# EAGLE design Dashboard rev1 (EAGLE 9.5.0)
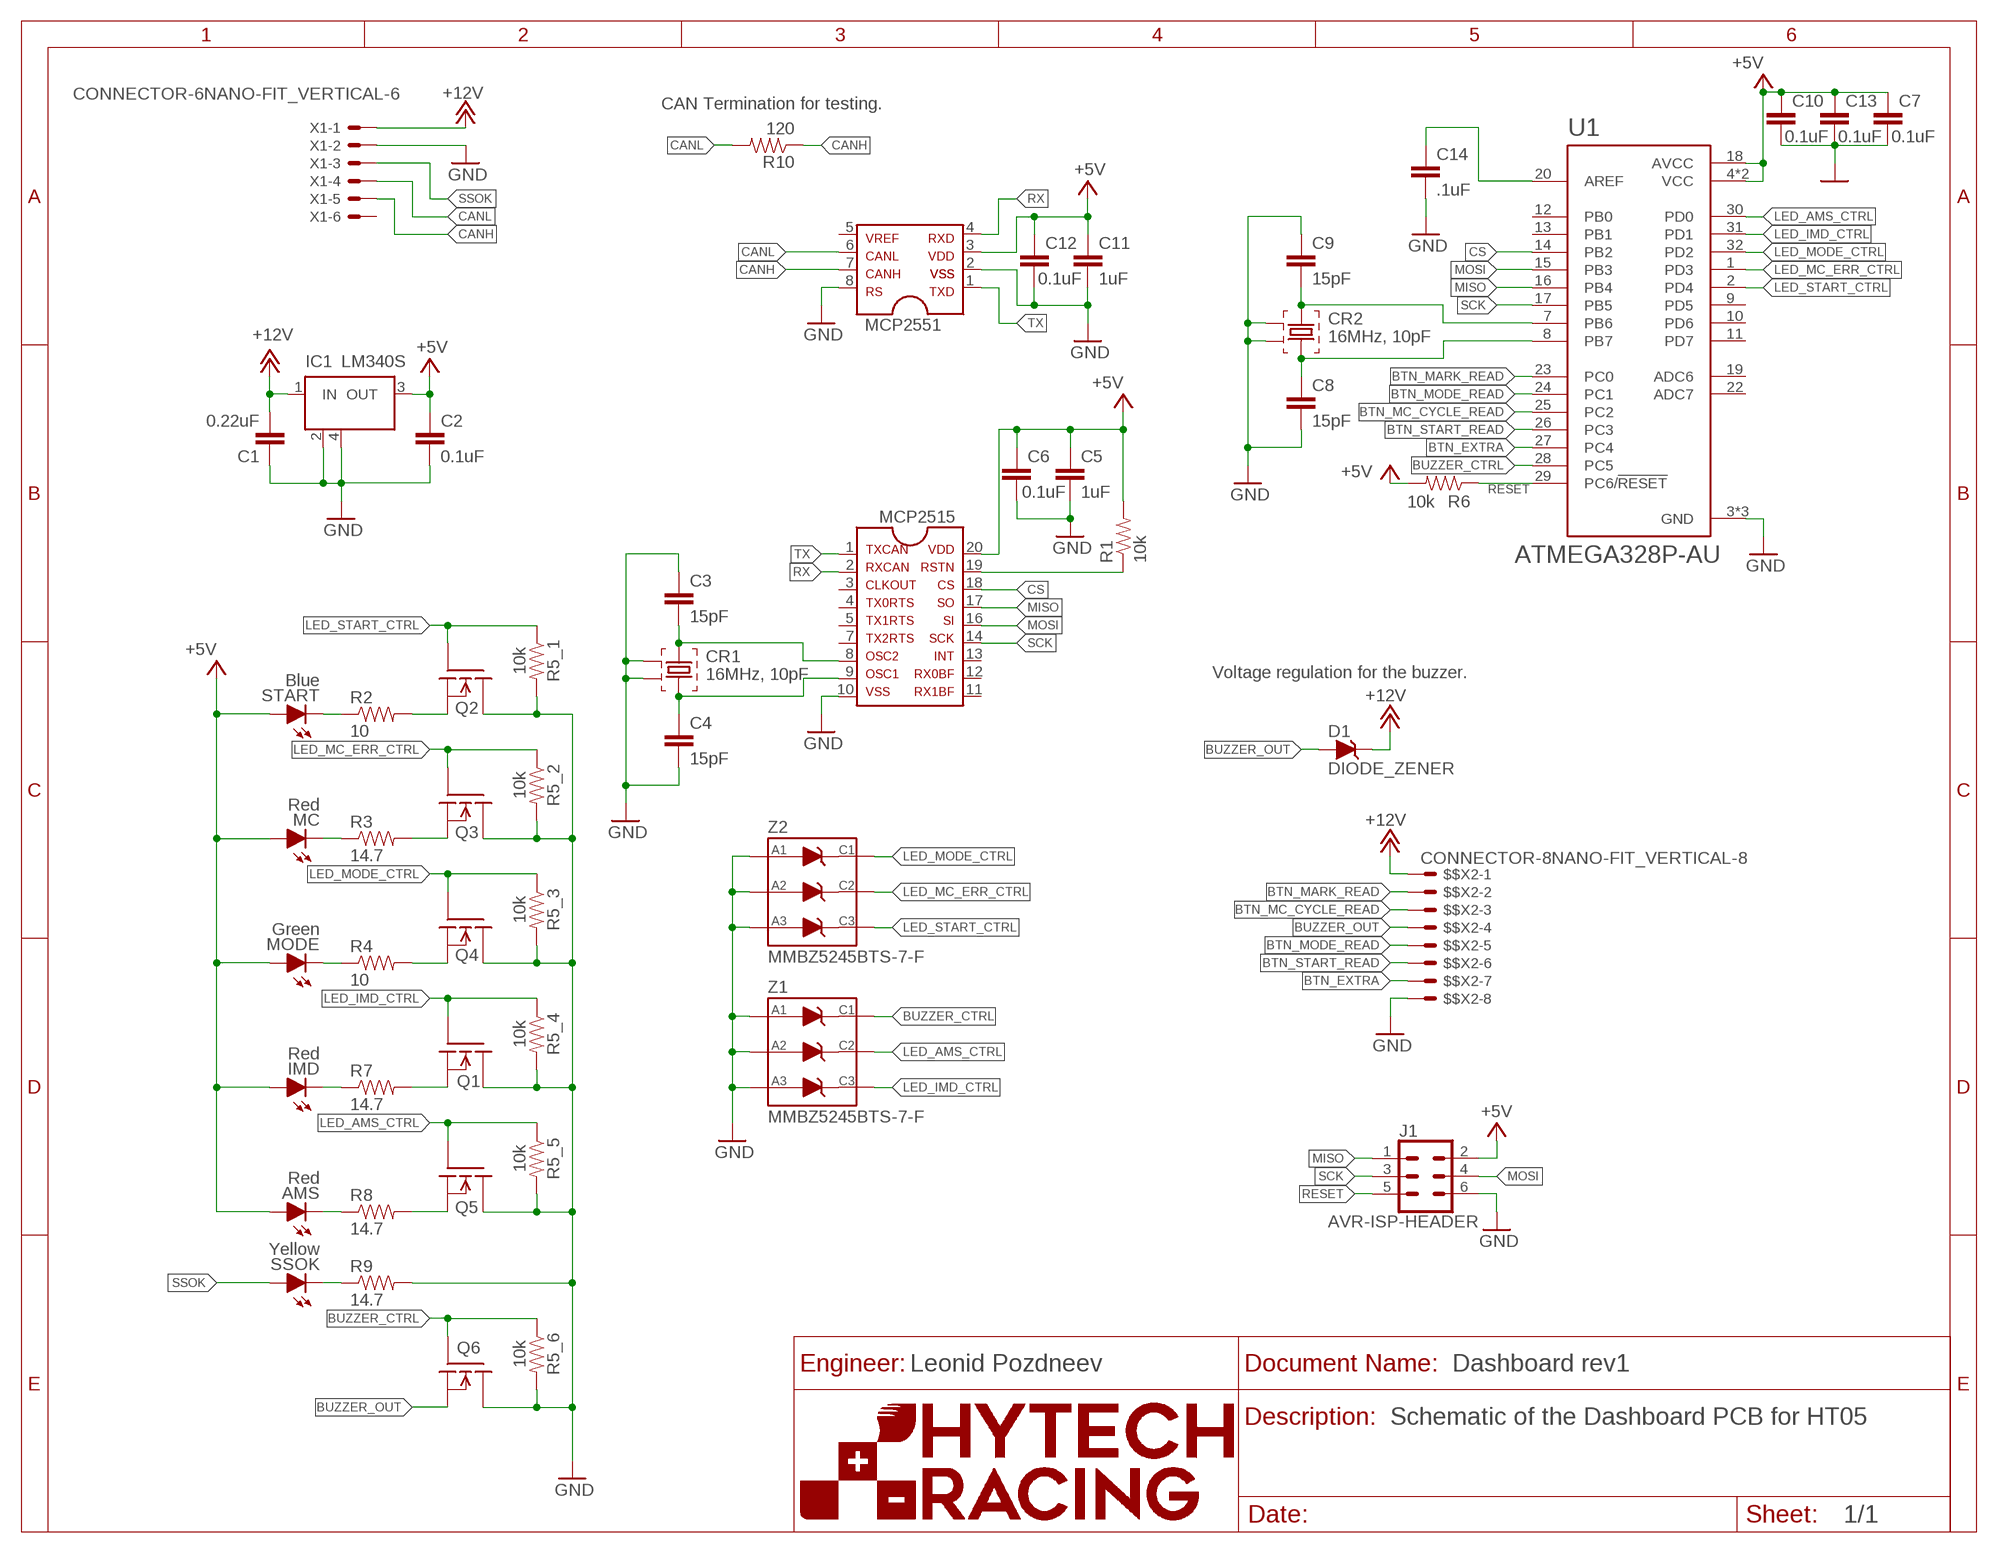
[diagram p0: schematic, sheet 1]
U$1 (FRAME_A_L): ORIENTATION: LANDSCAPE; SIZE: A

## Parts
$$X2  CONNECTOR-8NANO-FIT_VERTICAL-8  [NANO-FIT_VERTICAL-8]
AMS  Red  LED  [CREE_XP-E2]
C1  0.22uF  CAP0603-CAP  [0603-CAP]
C2  0.1uF  CAP0603-CAP  [0603-CAP]
C3  15pF  CAP0603-CAP  [0603-CAP]
C4  15pF  CAP0603-CAP  [0603-CAP]
C5  1uF  CAP0603-CAP  [0603-CAP]
C6  0.1uF  CAP0603-CAP  [0603-CAP]
C7  0.1uF  CAP0603-CAP  [0603-CAP]
C8  15pF  CAP0603-CAP  [0603-CAP]
C9  15pF  CAP0603-CAP  [0603-CAP]
C10  0.1uF  CAP0603-CAP  [0603-CAP]
C11  1uF  CAP0603-CAP  [0603-CAP]
C12  0.1uF  CAP0603-CAP  [0603-CAP]
C13  0.1uF  CAP0603-CAP  [0603-CAP]
C14  .1uF  CAP0603-CAP  [0603-CAP]
CR1  16MHz, 10pF  ABM3B  [ABM3B]
CR2  16MHz, 10pF  ABM3B  [ABM3B]
D1  DIODE_ZENER  [SOT23]
IC1  LM340S  [SOT223]
IMD  Red  LED  [CREE_XP-E2]
J1  AVR-ISP-HEADER  [2X03]
MC  Red  LED  [CREE_XP-E2]
MCP2515  MCP2515TSSOP  [TSSOP-20]
MCP2551  MCP2551  [SOIC-08]
MODE  Green  LED  [CREE_XP-E2]
Q1  DMG3406LSOT  [SOT23]
Q2  DMG3406LSOT  [SOT23]
Q3  DMG3406LSOT  [SOT23]
Q4  DMG3406LSOT  [SOT23]
Q5  DMG3406LSOT  [SOT23]
Q6  DMG3406LSOT  [SOT23]
R1  10k  RESISTOR0603  [0603-RES]
R2  10  RESISTOR0603  [0603-RES]
R3  14.7  RESISTOR0603  [0603-RES]
R4  10  RESISTOR0603  [0603-RES]
R5  10k  CAT16-F8_1%  [CAT16-*8]
R6  10k  RESISTOR0603  [0603-RES]
R7  14.7  RESISTOR0603  [0603-RES]
R8  14.7  RESISTOR0603  [0603-RES]
R9  14.7  RESISTOR0603  [0603-RES]
R10  120  RESISTOR0603-RES  [0603-RES]
SSOK  Yellow  LED  [CREE_XP-E2]
START  Blue  LED  [CREE_XP-E2]
U1  ATMEGA328P-AU  [QFP80P900X900X120-32N]
X1  CONNECTOR-6NANO-FIT_VERTICAL-6  [NANO-FIT_VERTICAL-6]
Z1  MMBZ5245BTS-7-F  [SOT363]
Z2  MMBZ5245BTS-7-F  [SOT363]

## Nets
+5V: AMS.P$1(A) C2.1 C5.1 C6.1 C7.1 C10.1 C11.1 C12.1 C13.1 IC1.3(OUT) IMD.P$1(A) J1.2 MC.P$1(A) MCP2515.20(VDD) MCP2551.3 MODE.P$1(A) R1.2 R6.2 START.P$1(A) U1.4(VCC) U1.6(VCC) U1.18(AVCC)
+12V: $$X2.P$1 C1.2 D1.3(C) IC1.1(IN) X1.P$1
BTN_EXTRA: $$X2.P$7 U1.27(PC4)
BTN_MARK_READ: $$X2.P$2 U1.23(PC0)
BTN_MC_CYCLE_READ: $$X2.P$3 U1.25(PC2)
BTN_MODE_READ: $$X2.P$5 U1.24(PC1)
BTN_START_READ: $$X2.P$6 U1.26(PC3)
BUZZER_CTRL: Q6.1(G) R5.P$6 U1.28(PC5) Z1.P$4(C1)
BUZZER_OUT: $$X2.P$4 D1.1(A) Q6.2(S)
CANH: MCP2551.7 R10.1 X1.P$5
CANL: MCP2551.6 R10.2 X1.P$4
CS: MCP2515.18(CS) U1.14(PB2)
GND: $$X2.P$8 C1.1 C2.2 C3.1 C4.2 C5.2 C6.2 C7.2 C8.2 C9.1 C10.2 C11.2 C12.2 C13.2 C14.2 CR1.P$2 CR1.P$4 CR2.P$2 CR2.P$4 IC1.2(GND) IC1.4(GND) J1.6 MCP2515.10(VSS) MCP2551.2 MCP2551.8 Q1.3(D) Q2.3(D) Q3.3(D) Q4.3(D) Q5.3(D) Q6.3(D) R5.P$11 R5.P$12 R5.P$13 R5.P$14 R5.P$15 R5.P$16 R9.2 U1.3(GND) U1.5(GND) U1.21(GND) X1.P$2 Z1.P$1(A1) Z1.P$2(A2) Z1.P$3(A3) Z2.P$1(A1) Z2.P$2(A2) Z2.P$3(A3)
LED_AMS_CTRL: Q5.1(G) R5.P$5 U1.30(PD0) Z1.P$5(C2)
LED_IMD_CTRL: Q1.1(G) R5.P$4 U1.31(PD1) Z1.P$6(C3)
LED_MC_ERR_CTRL: Q3.1(G) R5.P$2 U1.1(PD3) Z2.P$5(C2)
LED_MODE_CTRL: Q4.1(G) R5.P$3 U1.32(PD2) Z2.P$4(C1)
LED_START_CTRL: Q2.1(G) R5.P$1 U1.2(PD4) Z2.P$6(C3)
MISO: J1.1 MCP2515.17(SO) U1.16(PB4)
MOSI: J1.4 MCP2515.16(SI) U1.15(PB3)
N$1: MCP2515.19(RSTN) R1.1
N$2: C4.1 CR1.P$3 MCP2515.9(OSC1)
N$3: C3.2 CR1.P$1 MCP2515.8(OSC2)
N$4: Q2.2(S) R2.2
N$5: C9.2 CR2.P$1 U1.7(PB6)
N$6: C8.1 CR2.P$3 U1.8(PB7)
N$8: C14.1 U1.20(AREF)
N$9: Q4.2(S) R4.2
N$10: MODE.P$2(C) R4.1
N$11: R2.1 START.P$2(C)
N$12: Q1.2(S) R7.2
N$13: IMD.P$2(C) R7.1
N$15: R9.1 SSOK.P$2(C)
N$16: AMS.P$2(C) R8.1
N$17: Q5.2(S) R8.2
N$18: Q3.2(S) R3.2
N$19: MC.P$2(C) R3.1
RESET: J1.5 R6.1 U1.29(PC6/!RESET)
RX: MCP2515.2(RXCAN) MCP2551.4
SCK: J1.3 MCP2515.14(SCK) U1.17(PB5)
SSOK: SSOK.P$1(A) X1.P$3
TX: MCP2515.1(TXCAN) MCP2551.1
Unconnected: MCP2515.3(CLKOUT) MCP2515.4(TX0RTS) MCP2515.5(TX1RTS) MCP2515.7(TX2RTS) MCP2515.11(RX1BF) MCP2515.12(RX0BF) MCP2515.13(INT) MCP2551.5 R5.P$7 R5.P$8 R5.P$9 R5.P$10 U1.9(PD5) U1.10(PD6) U1.11(PD7) U1.12(PB0) U1.13(PB1) U1.19(ADC6) U1.22(ADC7) X1.P$6

## Notes on the sheet
- CAN Termination for testing.
- Voltage regulation for the buzzer.
- Leonid Pozdneev
- Schematic of the Dashboard PCB for HT05

## Library data of the parts
$$X2 = HyTechDevices:CONNECTOR-8: Mini-Fit Junior connector 8 pole Source: http://www.molex.com
AMS IMD MC MODE SSOK START = HyTechDevices:LED: Light Emitting Diode (LED) Source: Dangerous Prototypes Eagle Library <https://github.com/DangerousPrototypes/Eagle_Part_Library>
C1-C14 = HyTechDevices:CAP: Capacitor Standard 0603 ceramic capacitor, and 0.1" leaded capacitor.
CR1 CR2 = HyTechDevices:ABM3B: ABM3B ceramic SMD crystal. Datasheet: https://www.mouser.com/datasheet/2/3/abm3b-39910.pdf
D1 = HyTechDevices:DIODE_ZENER: ZENER DIODE
IC1 = linear:LM340S: 3-Terminal Positive Regulators Source: http://cache.national.com/ds/LM/LM340.pdf
J1 = HyTechDevices:AVR-ISP-HEADER: AVR ISP 6-pin Header Reference <https://en.wikipedia.org/wiki/In-system_programming>; DIGIKEY: S2011EC-03-ND
MCP2515 = HyTechDevices:MCP2515: MCP2515 CAN Controller with SPI Interface Datasheet <http://ww1.microchip.com/downloads/en/DeviceDoc/21801G.pdf>
MCP2551 = HyTechDevices:MCP2551: MCP2551 High-Speed CAN Transceiver Product Webpage <https://www.microchip.com/wwwproducts/en/MCP2551> Datasheet <http://ww1.microchip.com/downloads/en/DeviceDoc/21667f.pdf> This device is outdated It is replaced by MCP2561. Comparison Page <https://www.microchip.com/wwwproducts/ProductCompare/MCP2551/MCP2561> Product Webpage <https://www.microchip.com/wwwproducts/en/MCP2561> Datasheet <http://ww1.microchip.com/downloads/en/DeviceDoc/20005167C.pdf>
Q1-Q6 = HyTechDevices:DMG3406L: Generic NPN MOSFET DMG3406L (SOT-23, 2.8 A 30V)
R1-R4 R6-R10 = HyTechDevices:RESISTOR: Resistor Basic schematic elements and footprints for 0603, 1206, and PTH resistors.
R5 = HyTechDevices:CAT16-*8: Bourns CAT16 series 8x 1% or 5% resistor array size 2506 Datasheet <https://www.bourns.com/docs/Product-Datasheets/CATCAY.pdf> Options: CAT16-F8: 1% tolerance CAT16-J8: 5% tolerance Alternative: CTS Resistor Products 742C163 series Datasheet <https://www.ctscorp.com/wp-content/uploads/74x.pdf>
U1 = HyTechDevices:ATMEGA328P-AU: ATmega Series 20 MHz 32 KB Flash 2 KB SRAM 8-Bit Microcontroller - TQFP-32; AVAILABILITY: Unavailable; DESCRIPTION: AVR AVR® ATmega Microcontroller IC 8-Bit 20MHz 32KB _16K x 16_ FLASH 32-TQFP _7x7_; MF: Microchip; MP: ATMEGA328P-AU; PACKAGE: TQFP-32 Microchip; PRICE: None
X1 = HyTechDevices:CONNECTOR-6: Mini-Fit Junior connector 6 pole Source: http://www.molex.com
Z1 Z2 = HyTechDevices:MMBZ5245BTS-7-F: Zener Diode Array 3 Independent

## Board
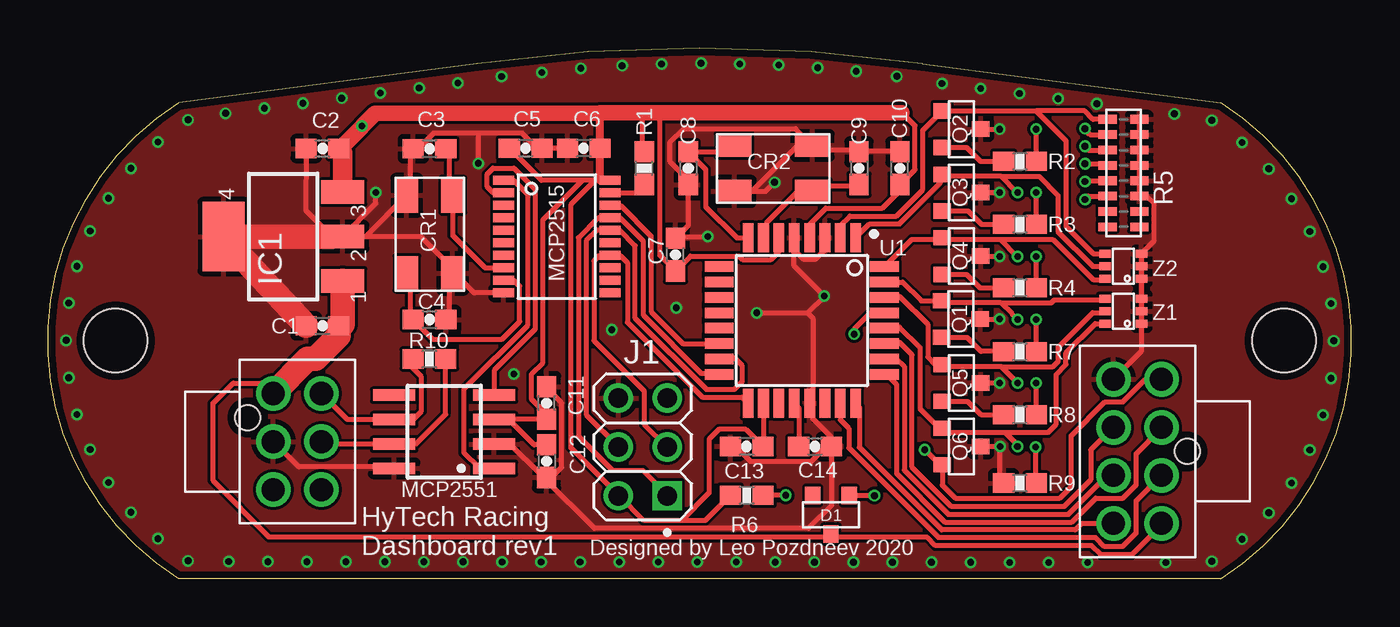
[diagram p1: board, top side]
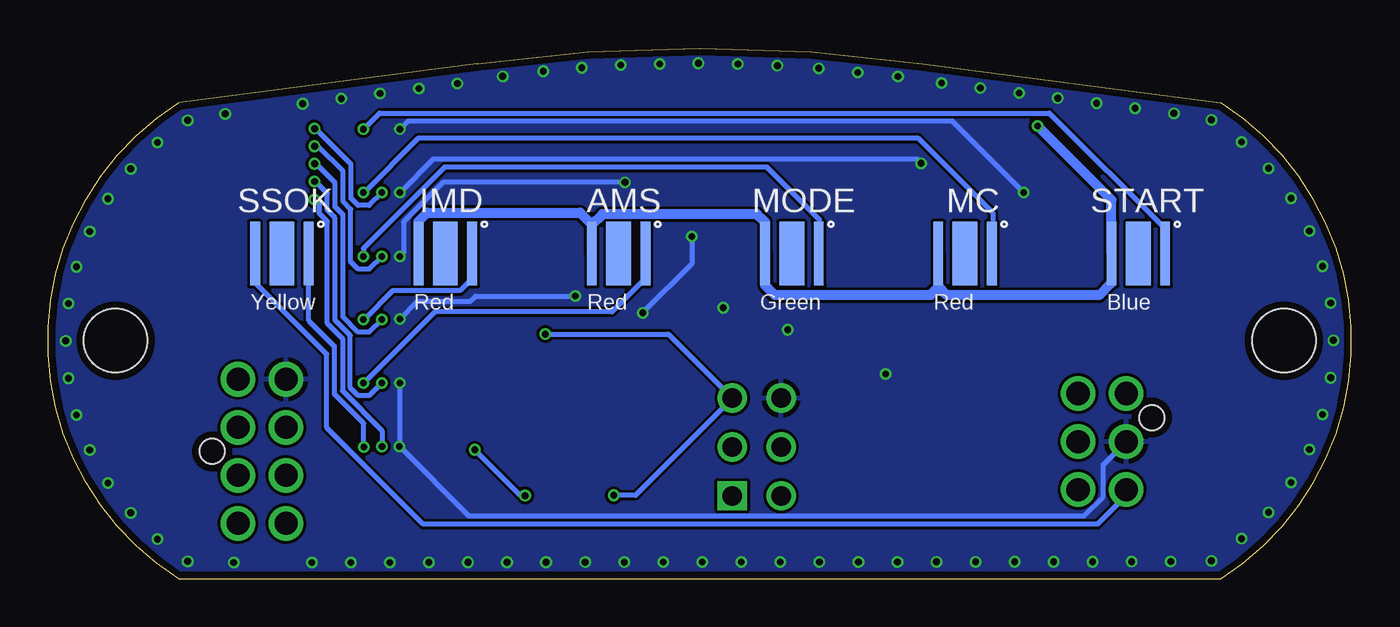
[diagram p2: board, bottom side, seen from below]

Size 67.84 x 27.62 mm. Coordinates in mm from the lower left corner, seen from the top.
Outline: 61.04,24.77 45.51,26.8 arc16 22.33,26.8 6.81,24.77 arc115 6.81,0 61.04,0 arc115 61.04,24.77
Outline: 61.04,24.77 61.04,24.77
Copper layers (1*16): Top 0.035559375mm / dielectric 1.6mm / Bottom 0.035559375mm
Design rules "DRC Oshpark": minimum track width 6mil, minimum drill 10mil, track to track 6mil, track to pad 6mil, pad to pad 6mil, via to via 6mil, smd to smd 6mil, copper to edge 15mil, drill to drill 6mil, minimum pad ring 5mil, minimum via ring 5mil, stop-mask expansion 2.5mil, vias tented up to drill 30mil, thermal gap 10mil
Holes 3.3 mm at 3.51,12.4 64.32,12.4

### Footprints (pad centres in the part's own frame; a part is rotated, then mirrored left to right if it is on the bottom)
NANO-FIT_VERTICAL-8 = drill 1.2: P$1 -3.75,0; P$2 -1.25,0; P$3 1.25,0; P$4 3.75,0; P$5 -3.75,2.5; P$6 -1.25,2.5; P$7 1.25,2.5; P$8 3.75,2.5 | hole 1.3: 0,-1.34
CREE_XP-E2 = smd 0.508 x 3.302: P$1 0.254,1.651; P$2 3.048,1.651 | smd 1.295 x 3.302: P$3 1.651,1.651
0603-CAP = smd 1.1 x 1: 1 -0.85,0; 2 0.85,0
ABM3B = smd 1.803 x 1.194: P$1 0.902,2.985; P$2 4.966,2.985; P$3 4.966,0.597; P$4 0.902,0.597
SOT23 = smd 0.8 x 0.9: 1 -0.95,-1; 2 0.95,-1; 3 0,1
SOT223 = smd 1.219 x 2.235: 1 -2.311,-3.099; 2 0,-3.099; 3 2.311,-3.099 | smd 3.6 x 2.2: 4 0,3.099
2X03 = drill 1.016 square: 1 -2.54,-1.27 | drill 1.016: 2 -2.54,1.27; 3 0,-1.27; 4 0,1.27; 5 2.54,-1.27; 6 2.54,1.27
TSSOP-20 = smd 0.45 x 1.1: 1 -2.925,-2.618; 2 -2.275,-2.618; 3 -1.625,-2.618; 4 -0.975,-2.618; 5 -0.325,-2.618; 6 0.325,-2.618; 7 0.975,-2.618; 8 1.625,-2.618; 9 2.275,-2.618; 10 2.925,-2.618; 11 2.925,2.918; 12 2.275,2.918; 13 1.625,2.918; 14 0.975,2.918; 15 0.325,2.918; 16 -0.325,2.918; 17 -0.975,2.918; 18 -1.625,2.918; 19 -2.275,2.918; 20 -2.925,2.918
SOIC-08 = smd 0.6 x 2.2: 1 -1.905,-2.6; 2 -0.635,-2.6; 3 0.635,-2.6; 4 1.905,-2.6; 5 1.905,2.6; 6 0.635,2.6; 7 -0.635,2.6; 8 -1.905,2.6
0603-RES = smd 1.1 x 1: 1 -0.85,0; 2 0.85,0
CAT16-*8 = smd 0.45 x 0.95: P$1 -2.8,-0.825; P$2 -2,-0.825; P$3 -1.2,-0.825; P$4 -0.4,-0.825; P$5 0.4,-0.825; P$6 1.2,-0.825; P$7 2,-0.825; P$8 2.8,-0.825; P$9 2.8,0.825; P$10 2,0.825; P$11 1.2,0.825; P$12 0.4,0.825; P$13 -0.4,0.825; P$14 -1.2,0.825; P$15 -2,0.825; P$16 -2.8,0.825
QFP80P900X900X120-32N = smd 1.5 x 0.55: 1 -4.3,2.8; 2 -4.3,2; 3 -4.3,1.2; 4 -4.3,0.4; 5 -4.3,-0.4; 6 -4.3,-1.2; 7 -4.3,-2; 8 -4.3,-2.8; 17 4.3,-2.8; 18 4.3,-2; 19 4.3,-1.2; 20 4.3,-0.4; 21 4.3,0.4; 22 4.3,1.2; 23 4.3,2; 24 4.3,2.8 | smd 0.55 x 1.5: 9 -2.8,-4.3; 10 -2,-4.3; 11 -1.2,-4.3; 12 -0.4,-4.3; 13 0.4,-4.3; 14 1.2,-4.3; 15 2,-4.3; 16 2.8,-4.3; 25 2.8,4.3; 26 2,4.3; 27 1.2,4.3; 28 0.4,4.3; 29 -0.4,4.3; 30 -1.2,4.3; 31 -2,4.3; 32 -2.8,4.3
NANO-FIT_VERTICAL-6 = drill 1.2: P$1 -2.5,0; P$2 0,0; P$3 2.5,0; P$4 -2.5,2.5; P$5 0,2.5; P$6 2.5,2.5 | hole 1.3: -1.25,-1.34
SOT363 = smd 0.61 x 0.432: P$1 -0.965,0.673; P$2 -0.965,0.023; P$3 -0.965,-0.627; P$4 0.93,0.673; P$5 0.93,0.023; P$6 0.93,-0.627

### Placement (x,y rotation side)
$$X2  57.96,6.64 90 top
AMS  39.79,15.27 0 bottom
C1  14.28,13.17 0 top
C2  14.28,22.39 180 top
C3  19.86,22.39 0 top
C4  19.86,13.5 0 top
C5  24.86,22.41 0 top
C6  27.88,22.41 180 top
C7  32.66,16.87 90 top
C8  33.32,21.37 270 top
C9  42.21,21.37 270 top
C10  44.34,21.37 90 top
C11  25.95,9.15 90 top
C12  25.95,6.13 270 top
C13  36.37,6.89 180 top
C14  39.92,6.89 0 top
CR1  18.08,20.86 270 top
CR2  40.68,23.15 180 top
D1  40.75,3.34 180 top
IC1  12.24,17.81 90 top
IMD  48.81,15.27 0 bottom
J1  30.96,6.87 90 top
MC  21.76,15.27 0 bottom
MCP2515  26.33,17.81 270 top
MCP2551  20.62,7.65 90 top
MODE  30.78,15.27 0 bottom
Q1  47.52,13.52 270 top
Q2  47.54,23.4 270 top
Q3  47.54,20.1 270 top
Q4  47.54,16.8 270 top
Q5  47.54,10.19 270 top
Q6  47.54,6.89 270 top
R1  31.03,21.37 90 top
R2  50.59,21.73 180 top
R3  50.59,18.45 180 top
R4  50.59,15.15 180 top
R5  55.97,21.12 270 top
R6  36.37,4.35 180 top
R7  50.59,11.82 180 top
R8  50.59,8.54 180 top
R9  50.59,4.99 180 top
R10  19.85,11.44 180 top
SSOK  57.32,15.27 0 bottom
START  12.74,15.27 0 bottom
U1  39.24,13.45 270 top
X1  11.73,7.15 270 top
Z1  55.95,13.95 180 top
Z2  55.95,16.29 180 top

### Tracks (layer width: path | path; a pad name or v marks a point on that pad's centre or on a via)
+5V  (via drill 0.35)
  Top 0.254: C5.1 25.68,20.74 27.83,20.74 | MCP2515.20 28.48,20.74 | 28.48,20.74 27.83,20.74 | U1.18 37.24,6.91 C13.1 36.33,7.78 34.92,7.78 34.41,7.27 34.41,4.48 32.96,3.03 | U1.4 39.63,18.43 40.48,19.29 43.43,19.29 44.34,20.2 C10.1 45.12,21.3 45.12,23.58 44.44,24.27 | U1.6 38.04,17.03 37.63,16.61 36.15,16.61 35.96,16.8 33.43,16.8 C7.1 31.84,16.84 31.84,24.15 31.96,24.27 | 27.83,20.74 25.76,18.68 25.76,11.26 25.17,10.67 25.17,9.34 25.95,8.56 C11.1 23.23,8.3 MCP2551.3 24,8.29 25.31,6.98 C12.1 | 28.48,20.74 27.2,19.46 27.2,6.85 29.69,4.36 J1.2 29.74,4.33 31.03,3.03 32.96,3.03 | R6.2 34.2,3.03 32.96,3.03 | R1.2 30.95,22.31 30.95,24.27
  Top 0.406: MCP2515.20 28.74,20.74 28.73,20.73 C6.1 28.73,24.24 28.73,24.27
  Top 0.813: C2.1 15.21,22.39 16.34,23.52 v16.34,23.56 17.02,24.24 28.73,24.24 | 28.73,24.27 30.95,24.27 31.96,24.27 44.44,24.27
  Top 1.016: C2.1 15.33,22.17 IC1.3
  Bottom 0.508: 21.51,15.19 21.08,14.77 13.13,14.77 12.49,15.4 START.P$1 12.49,19.72 16.33,23.56 v16.34,23.56 | 21.51,15.19 MC.P$1 | 21.51,15.19 21.89,14.81 21.89,14.77 30.02,14.77 30.51,15.26 30.51,16.91 MODE.P$1 30.52,18.58 30.93,18.98 38.98,18.98 39.54,18.42 | IMD.P$1 48.56,18.6 48.1,19.06 40.15,19.06 39.54,18.45 39.54,18.42 | 39.54,18.42 AMS.P$1
+12V
  Top 0.254: X1.P$1 11.67,9.65 11.13,10.19 9.65,10.19 8.58,9.12 8.58,5.14 11.5,2.18 40.59,2.18 D1.3 40.93,2.16 45.76,2.16 46.19,1.74 54.31,1.74 54.8,1.25 56.4,1.25 57.83,2.68 57.83,2.76 $$X2.P$1
  Top 1.27: IC1.1 15.33,13.25 C1.2 15.13,12.65 13.93,11.44 13.52,11.44 X1.P$1
BTN_EXTRA
  Top 0.254: $$X2.P$7 54.28,6.71 54.28,5.17 52.88,3.77 47.03,3.77 44.97,5.82 44.97,11.66 44.33,12.3 43.6,12.3 U1.27
BTN_MARK_READ
  Top 0.254: U1.23 41.24,8.28 41.69,7.83 41.69,6.81 46.36,2.14 54.53,2.14 54.99,1.68 55.92,1.68 56.64,2.4 56.64,4.07 $$X2.P$2
BTN_MC_CYCLE_READ
  Top 0.254: U1.25 43.64,10.65 44.16,10.12 44.16,5.49 46.69,2.95 53.28,2.95 54.53,4.21 55.94,4.21 56.64,4.9 56.64,6.51 57.96,7.83 $$X2.P$3
BTN_MODE_READ
  Top 0.254: U1.24 42.23,8.95 42.23,6.84 46.52,2.55 53.47,2.55 53.78,2.86 55.43,2.86 $$X2.P$5
BTN_START_READ
  Top 0.254: U1.26 43.56,11.46 44.16,11.46 44.57,11.06 44.57,5.65 46.86,3.36 53.11,3.36 55.14,5.39 $$X2.P$6
BUZZER_CTRL  (via drill 0.35)
  Top 0.254: U1.28 43.6,13.1 44.33,13.1 45.38,12.05 45.38,8.86 46.39,7.84 Q6.1 46.54,7.61 49.83,7.61 | 49.83,7.61 52.03,7.61 52.47,8.06 52.47,10.63 52.99,11.14 52.99,11.77 54.5,13.28 Z1.P$4 | 49.83,7.61 50.46,6.98 v50.46,6.89 | v53.97,19.74 54.14,19.92 R5.P$6
  Bottom 0.254: v53.97,19.74 53.74,19.51 53.74,19.03 53.31,18.6 53.31,13.29 52.52,12.51 52.52,9.78 50.46,7.72 v50.46,6.89
BUZZER_OUT  (via drill 0.35)
  Top 0.254: $$X2.P$4 57.12,10.39 55.94,9.21 55.01,9.21 53.26,7.45 53.26,4.8 52.66,4.2 47.22,4.2 46.54,4.87 Q6.2 46.41,5.94 v45.63,6.72 | v43.01,4.33 43,4.34 D1.1
  Bottom 0.254: v43.01,4.33 43.24,4.33 v45.63,6.72
CANH
  Top 0.254: X1.P$5 14.36,7.02 MCP2551.7 19.16,7.02 20.7,8.56 R10.1
CANL
  Top 0.254: X1.P$4 15.59,8.29 MCP2551.6 18.07,8.34 19.06,8.34 19.44,8.72 19.44,10.52 19,10.96 R10.2
CS
  Top 0.254: MCP2515.18 29.79,19.44 31.39,17.84 31.39,13.9 33.05,12.24 U1.14
GND  (via drill 0.35)
  Top 0.152: IC1.2 16.53,17.81
  Top 0.254: C12.2 25.79,5.28 23.92,7.15 23.35,7.15 MCP2551.2 | C11.2 25.95,9.94 | 25.95,9.94 25.95,9.75 | C12.2 26.21,5.28 26.73,5.81 26.73,9.16 25.95,9.94 | MCP2551.8 17.94,5.83 13.05,5.83 X1.P$2 | C4.2 20.88,13.67 20.88,15.72 CR1.P$2 | MCP2515.10 22.19,14.88 21.17,15.9 CR1.P$2 | C3.1 19.01,22.13 | CR1.P$2 21.06,16.16 19.41,17.81 17.32,17.81 17.3,17.83 17.29,17.81 16.53,17.81 CR1.P$4 18.85,20.14 18.85,21.98 19.01,22.13 | C6.2 C5.2 25.46,22.41 24.68,23.19 22.4,23.19 | 22.4,23.19 20.06,23.19 19.01,22.13 | C2.2 13.42,19.17 14.78,17.81 | CR2.P$4 40.04,22.3 42.13,22.3 C9.1 42.23,22.25 44.32,22.25 C10.2 | U1.21 39.81,9.31 | 39.81,9.31 39.81,8.33 40.77,7.36 C14.2 | 26.21,5.53 C12.2 | C12.2 25.87,5.2 | 25.87,5.2 25.84,5.17 | CR2.P$4 39.02,22.55 36.63,20.16 CR2.P$2 37.34,20.16 v37.81,20.63 | R5.P$16 R5.P$15 R5.P$14 R5.P$13 R5.P$12 R5.P$11 57.2,19.92 57.55,19.56 57.55,17.56 Z2.P$3 Z2.P$2 Z2.P$1 Z1.P$3 Z1.P$2 Z1.P$1 56.91,11.85 $$X2.P$8 | v49.52,16.77 48.57,16.77 Q4.3 | Q1.3 v49.52,13.52 | Q5.3 v49.52,10.19 | v49.52,20.1 Q3.3 | Q2.3 v49.52,23.4 | Q6.3 v49.55,6.89 49.55,5.18 R9.2 | IC1.2 17.06,19.54 v17.06,20.1 | 22.4,23.19 v22.4,21.62 | v34.33,17.81 32.75,17.81 C7.2 33.32,18.38 C8.2 33.32,20.77 32.38,21.71 32.38,22.73 32.39,22.73 33.08,23.43 38.91,23.43 CR2.P$4 | 39.81,9.81 39.81,9.31 | 39.82,9.82 39.81,9.81 | C13.2 35.77,6.89 36.55,6.11 39.74,6.11 40.52,6.89 C14.2 | C14.2 40.77,3.8 39.59,2.62 28.44,2.62 25.87,5.2 | v40.4,14.72 | v40.4,14.72 38.83,16.3 U1.5 38.84,17.12 39.25,16.72 39.33,16.64 39.95,16.64 40.44,17.12 U1.3 | 39.53,13.84 v40.4,14.72 | v36.89,13.84 39.53,13.84 | 39.53,13.84 39.81,13.57 39.81,9.81
  Top 1.016: C1.1
  Top 1.27: 14.78,17.81 IC1.4 9.14,17.75 C1.1
  Bottom 0.254: v17.06,20.1 20.8,23.83 49.09,23.83 v49.52,23.4 | v22.4,21.62 22.62,21.85 47.77,21.85 v49.52,20.1 | v49.52,16.77 49.35,16.95 49.35,18.57 47.28,20.63 v37.81,20.63 | v49.52,10.19 49.55,10.17 v49.55,6.89 45.94,3.28 13.92,3.28 12.92,4.28 12.92,5.95 X1.P$2 | v49.52,13.52 48.61,14.44 45.87,14.44 45.59,14.72 v40.4,14.72 | v34.33,17.81 34.33,16.4 v36.89,13.84
  other vias: 7.29,0.94 5.71,2.1 4.32,3.46 3.14,5.02 2.19,6.73 1.5,8.56 1.08,10.46 0.94,12.41 1.08,14.36 1.5,16.27 2.19,18.1 3.14,19.81 4.32,21.36 5.71,22.73 7.29,23.89 21.33,25.8 19.32,25.54 17.3,25.28 15.29,25.01 13.27,24.75 11.26,24.49 9.24,24.22 60.57,0.92 62.15,2.07 63.54,3.44 64.72,4.99 65.67,6.7 66.36,8.53 66.78,10.44 66.92,12.39 66.78,14.34 66.36,16.24 65.67,18.07 64.72,19.78 63.54,21.34 62.15,22.71 60.57,23.86 46.53,25.78 48.54,25.51 50.56,25.25 52.57,24.99 54.59,24.73 58.62,24.2 9.41,0.9 11.44,0.9 13.47,0.9 15.5,0.89 17.53,0.89 19.57,0.89 21.6,0.89 23.63,0.89 25.66,0.88 27.69,0.88 29.73,0.88 31.76,0.88 33.79,0.88 35.82,0.87 37.85,0.87 39.89,0.87 41.92,0.87 43.95,0.87 45.98,0.86 48.01,0.86 50.05,0.86 52.08,0.86 54.11,0.86 58.17,0.85 23.61,26.14 25.7,26.35 27.72,26.57 29.88,26.7 31.93,26.79 33.99,26.83 36,26.8 38.03,26.73 40.06,26.6 42.06,26.41 44.18,26.15 29.35,12.97 32.7,14.11 24.24,10.66
  pour Top: -0.42,18.68 8.59,27.7 59.9,27.7 67.78,19.82 67.78,-0.5 4.53,-0.5 -0.42,4.46
  pour Bottom: -6.77,13.45 7.48,27.7 59.9,27.7 67.78,19.82 67.78,3.24 64.04,-0.5 -1.03,-0.5
LED_AMS_CTRL  (via drill 0.35)
  Top 0.254: v50.46,10.19 49.62,11.04 | 49.62,11.04 46.65,11.04 Q5.1 46.19,11.14 45.79,11.55 45.79,13.24 44.33,14.7 43.6,14.7 U1.30 | 49.62,11.04 52.31,11.04 52.58,11.31 52.58,12.06 54.37,13.85 54.94,13.85 Z1.P$5 | v53.97,20.68 54,20.72 R5.P$5
  Bottom 0.254: v50.46,10.19 51.12,9.54 51.7,9.54 52.11,9.95 52.11,12.68 52.9,13.46 52.9,18.79 53.31,19.19 53.31,20.08 53.9,20.67 v53.97,20.68
LED_IMD_CTRL  (via drill 0.35)
  Top 0.254: v50.46,13.5 50.18,13.78 50.18,13.79 49.61,14.37 | 49.61,14.37 46.62,14.37 Q1.1 45.45,14.47 44.48,15.44 U1.31 | 49.61,14.37 52.22,14.37 52.37,14.51 54.95,14.51 Z1.P$6 | v53.97,21.6 55.07,21.6 R5.P$4
  Bottom 0.254: v50.46,13.5 51.12,12.84 51.7,12.84 52.49,13.63 52.49,18.95 52.9,19.36 52.9,20.6 53.89,21.6 v53.97,21.6
LED_MC_ERR_CTRL  (via drill 0.35)
  Top 0.254: v50.46,20.1 49.62,20.94 | 49.62,20.94 46.65,20.94 Q3.1 46.44,20.95 46.44,20.6 44.32,18.47 42.77,18.47 U1.1 | 49.62,20.94 51.58,20.94 52.57,19.95 52.57,18.07 54.37,16.27 Z2.P$5 | v53.97,23.43 53.94,23.41 54.24,23.12 R5.P$2
  Bottom 0.254: v50.46,20.1 51.12,19.44 51.71,19.44 52.09,19.82 52.09,21.6 53.92,23.43 v53.97,23.43
LED_MODE_CTRL  (via drill 0.35)
  Top 0.254: v50.46,16.77 49.57,17.67 | 46.62,17.67 49.57,17.67 | 46.62,17.67 Q4.1 | U1.32 44.96,17.67 46.62,17.67 | Z2.P$4 54.97,15.57 54.4,15.57 52.3,17.67 49.57,17.67 | v53.97,22.51 54.14,22.32 R5.P$3
  Bottom 0.254: v50.46,16.77 51.12,16.11 51.7,16.11 52.09,16.5 52.09,19.24 52.5,19.65 52.5,21.23 53.79,22.52 v53.97,22.51
LED_START_CTRL
  Top 0.254: 51.42,24.35 Q2.1 45.53,23.34 45.53,20.26 44.15,18.88 41.73,18.88 41.23,18.38 U1.2 | Z2.P$6 54.41,16.92 52.98,18.35 52.98,22.79 51.42,24.35 | R5.P$1 54.39,23.92 53.96,24.35 51.42,24.35
MISO
  Top 0.254: U1.16 34.89,10.69 34.02,10.69 30.98,13.72 30.98,17.58 29.76,18.8 MCP2515.17 28.63,18.79 27.6,17.76 27.6,7.43 29.38,5.65 30.96,5.65 32.23,4.38 J1.1
MOSI
  Top 0.254: U1.15 34.97,11.48 35.75,11.48 36.14,11.09 36.14,10.28 35.73,9.86 34.26,9.86 30.56,13.56 30.56,17.35 29.76,18.15 MCP2515.16 28.56,18.14 28.01,17.59 28.01,8.54 J1.4
N$1
  Top 0.254: MCP2515.19 29.26,20.1 31.03,20.1 R1.1
N$2
  Top 0.254: CR1.P$3 18.85,15.72 18.85,13.65 C4.1 20.02,12.48 23.64,12.48 24.54,13.38 24.54,15.23 24.23,15.55 MCP2515.9
N$3
  Top 0.254: MCP2515.8 22.75,16.19 21.06,17.88 CR1.P$1 20.88,20.14 20.88,22.21 C3.2
N$4
  Top 0.254: Q2.2 47.81,22.45 48.53,21.73 R2.2
N$5
  Top 0.254: C9.2 42.16,20.52 42.06,20.42 40.29,20.42 40.04,20.16 CR2.P$1 39.03,20.16 37.41,18.53 37.41,17.91 U1.7
N$6
  Top 0.254: CR2.P$3 35.39,22.22 C8.1 34.23,21.31 34.23,19.36 35.85,17.75 U1.8
N$8
  Top 0.254: U1.20 39.07,8.91 C14.1
N$9
  Top 0.254: Q4.2 47.81,15.85 48.51,15.15 R4.2
N$10  (via drill 0.35)
  Top 0.254: R4.1 51.44,16.76 v51.43,16.77
  Bottom 0.254: MODE.P$2 27.69,16.96 27.69,18.69 30.42,21.42 47.21,21.42 51.43,17.2 v51.43,16.77
N$11  (via drill 0.35)
  Top 0.254: R2.1 51.44,23.39 v51.43,23.4
  Bottom 0.254: v51.43,23.4 50.59,24.24 15.71,24.24 9.66,18.18 9.66,16.96 START.P$2
N$12
  Top 0.254: Q1.2 47.83,12.57 48.56,11.84 49.71,11.84 R7.2
N$13  (via drill 0.35)
  Top 0.254: R7.1 51.44,13.48 v51.43,13.5
  Bottom 0.254: v51.43,13.5 51.39,13.5 49.89,14.99 46.4,14.99 45.73,15.67 45.73,16.89 IMD.P$2
N$15  (via drill 0.35)
  Top 0.254: R9.1 51.4,5.02 v51.4,6.87
  Bottom 0.254: v51.4,6.87 51.4,8.09 52.93,9.61 52.93,12.09 54.27,13.43 SSOK.P$2
N$16  (via drill 0.35)
  Top 0.254: R8.1 51.44,10.18 v51.43,10.19
  Bottom 0.254: AMS.P$2 36.71,16.89 36.71,15.67 38.48,13.9 47.69,13.9 51.39,10.19 v51.43,10.19
N$17
  Top 0.254: Q5.2 47.86,9.24 48.56,8.54 R8.2
N$18
  Top 0.254: Q3.2 47.88,19.15 48.58,18.45 R3.2
N$19  (via drill 0.35)
  Top 0.254: R3.1 51.44,20.09 v51.43,20.1
  Bottom 0.254: MC.P$2 18.67,16.96 18.67,19.05 22.54,22.92 48.58,22.92 51.39,20.1 v51.43,20.1
RESET  (via drill 0.35)
  Top 0.254: v41.95,12.73 41.95,12.98 42.81,13.84 U1.29 | v38.4,4.35 R6.1
  Bottom 0.254: v41.95,12.73 35.55,12.73 J1.5 32.51,9.13 32.48,9.13 37.26,4.35 v38.4,4.35
RX
  Top 0.254: MCP2515.2 23.17,20.09 22.85,20.4 22.85,21.06 23.16,21.37 24.25,21.37 25.36,20.27 25.36,12.99 23.22,10.85 MCP2551.4
SCK
  Top 0.254: U1.17 36.13,9.46 34.05,9.46 30.16,13.35 30.16,16.45 29.79,16.82 29.27,16.82 MCP2515.14 28.71,16.84 28.42,16.54 28.42,12.4 31.03,9.79 31.03,8.06 J1.3
SSOK
  Bottom 0.254: X1.P$3 11.73,4.35 13.23,2.85 48.32,2.85 53.33,7.87 53.33,11.69 57.08,15.44 57.08,16.91 SSOK.P$1
TX
  Top 0.254: MCP2515.1 24.23,20.75 24.95,20.02 24.95,13.18 21.63,9.86 21.63,6.57 22.46,5.75 MCP2551.1

### Text on the board
tNames: Z2 | Z1 | MCP2551 | HyTech Racing / Dashboard rev1 | Designed by Leo Pozdneev 2020